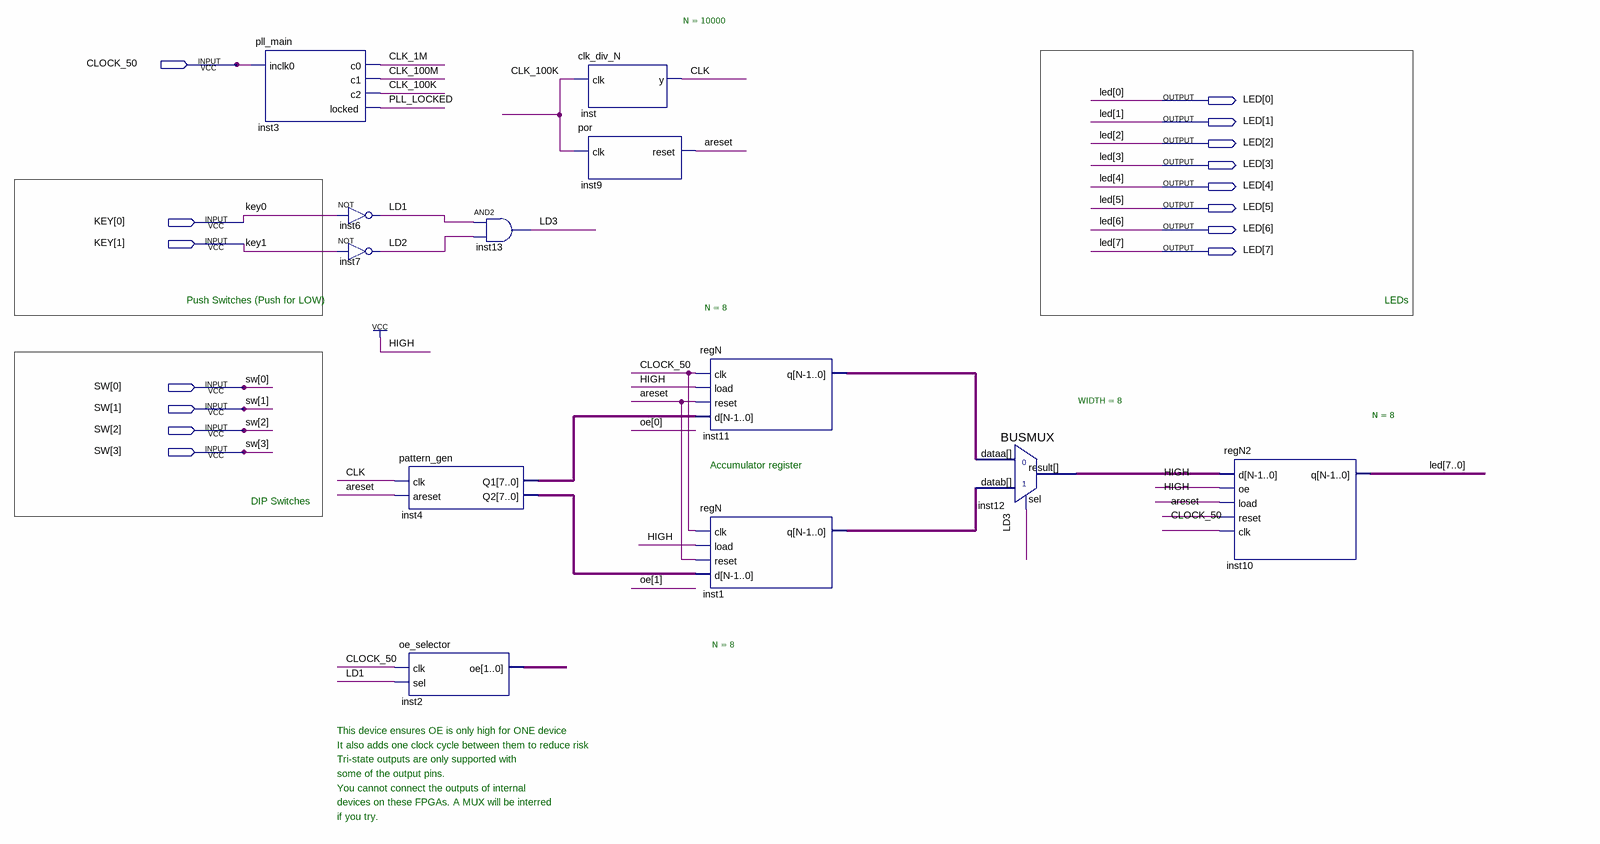
[diagram p0: schematic sheet]
// Quartus schematic TopLevelSchematic.bdf as structural Verilog: 12 symbols, 15 pins
module TopLevelSchematic (
  input  CLOCK_50,
  input  [1:0] KEY,
  input  [3:0] SW,
  output [7:0] LED
);

  wire areset, CLK, CLK_1M, CLK_100K, CLK_100M, LD1, LD2, LD3, PLL_LOCKED;
  wire [1:0] inst2_oe;
  wire [7:0] inst1_q, inst4_q1, inst4_q2, inst11_q, inst12_result;

  pll_main inst3 (.inclk0(CLOCK_50), .c0(CLK_1M), .c1(CLK_100M), .c2(CLK_100K), .locked(PLL_LOCKED));
  not inst6 (LD1, KEY[0]);
  not inst7 (LD2, KEY[1]);
  pattern_gen inst4 (.clk(CLK), .areset(areset), .Q1(inst4_q1), .Q2(inst4_q2));
  oe_selector inst2 (.clk(CLOCK_50), .sel(LD1), .oe(inst2_oe));
  and inst13 (LD3, LD1, LD2);
  clk_div_N #(.N(10000)) inst (.clk(CLK_100K), .y(CLK));
  por inst9 (.clk(CLK_100K), .reset(areset));
  regN #(.N(8)) inst11 (.clk(CLOCK_50), .load(1'b1), .reset(areset), .d(inst4_q1), .q(inst11_q));
  regN #(.N(8)) inst1 (.clk(CLOCK_50), .load(1'b1), .reset(areset), .d(inst4_q2), .q(inst1_q));
  BUSMUX #(.WIDTH(8)) inst12 (.datab(inst1_q), .sel(LD3), .dataa(inst11_q), .result(inst12_result));
  regN2 #(.N(8)) inst10 (.d(inst12_result), .oe(1'b1), .load(1'b1), .reset(areset), .clk(CLOCK_50), .q(LED));

  // Notes on the sheet:
  //   Push Switches (Push for LOW)
  //   LEDs
  //   Accumulator register
  //   DIP Switches
  //   This device ensures OE is only high for ONE device
  //   It also adds one clock cycle between them to reduce risk
  //   Tri-state outputs are only supported with
  //   some of the output pins.
  //   You cannot connect the outputs of internal
  //   devices on these FPGAs. A MUX will be interred
  //   if you try.
endmodule
